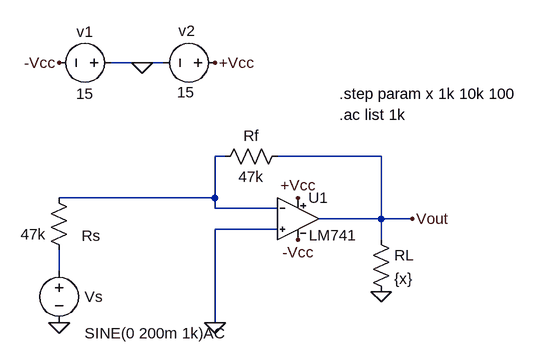
[diagram p0: schematic CCVS.asc]
CCVS.asc, the LTspice schematic file:
Version 4
SHEET 1 880 680
WIRE -96 -80 -144 -80
WIRE -64 -80 -96 -80
WIRE 32 64 16 64
WIRE 272 64 112 64
WIRE 16 128 16 64
WIRE 16 128 -224 128
WIRE 16 144 16 128
WIRE 112 144 16 144
WIRE 272 160 272 64
WIRE 272 160 176 160
WIRE 320 160 272 160
WIRE 112 176 16 176
WIRE 272 192 272 160
WIRE -224 240 -224 208
WIRE 16 320 16 176
FLAG -224 320 0
FLAG 16 320 0
FLAG -96 -80 0
FLAG 320 160 Vout
FLAG 144 128 +Vcc
FLAG 144 192 -Vcc
FLAG -224 -80 -Vcc
FLAG 16 -80 +Vcc
FLAG 272 272 0
SYMBOL voltage -128 -80 R90
WINDOW 0 -32 56 VBottom 2
WINDOW 3 32 56 VTop 2
SYMATTR InstName v1
SYMATTR Value 15
SYMBOL voltage 32 -80 R90
WINDOW 0 -49 72 VLeft 2
WINDOW 3 45 47 VRight 2
WINDOW 123 0 0 Left 2
WINDOW 39 0 0 Left 2
SYMATTR InstName v2
SYMATTR Value 15
SYMBOL voltage -224 224 R0
WINDOW 0 39 56 Left 2
WINDOW 3 39 112 Left 2
WINDOW 123 39 84 Left 2
WINDOW 39 0 0 Left 2
SYMATTR InstName Vs
SYMATTR Value SINE(0 200m 1k)AC
SYMBOL res 128 48 R90
WINDOW 0 0 56 VBottom 2
WINDOW 3 32 56 VTop 2
SYMATTR InstName Rf
SYMATTR Value 47k
SYMBOL res -208 224 R180
WINDOW 0 -48 38 Left 2
WINDOW 3 36 40 Left 2
SYMATTR InstName Rs
SYMATTR Value 47k
SYMBOL LM741 144 96 R0
SYMATTR InstName U1
SYMBOL res 256 176 R0
SYMATTR InstName RL
SYMATTR Value {x}
TEXT 208 0 Left 2 !.ac list 1k
TEXT 208 -32 Left 2 !.step param x 1k 10k 100

The netlist it stands for:
* CCVS.asc
v1 0 -Vcc 15
v2 +Vcc 0 15
Vs N002 0 SINE(0 200m 1k)AC
Rf Vout N001 47k
Rs N002 N001 47k
XU1 0 N001 +Vcc -Vcc Vout LM741  ; pins In+ In- V+ V- OUT
RL Vout 0 {x}
.ac list 1k
.step param x 1k 10k 100
.lib LM741.lib
.backanno
.end